# Altium schematic sheet Main.SchDoc
size A3
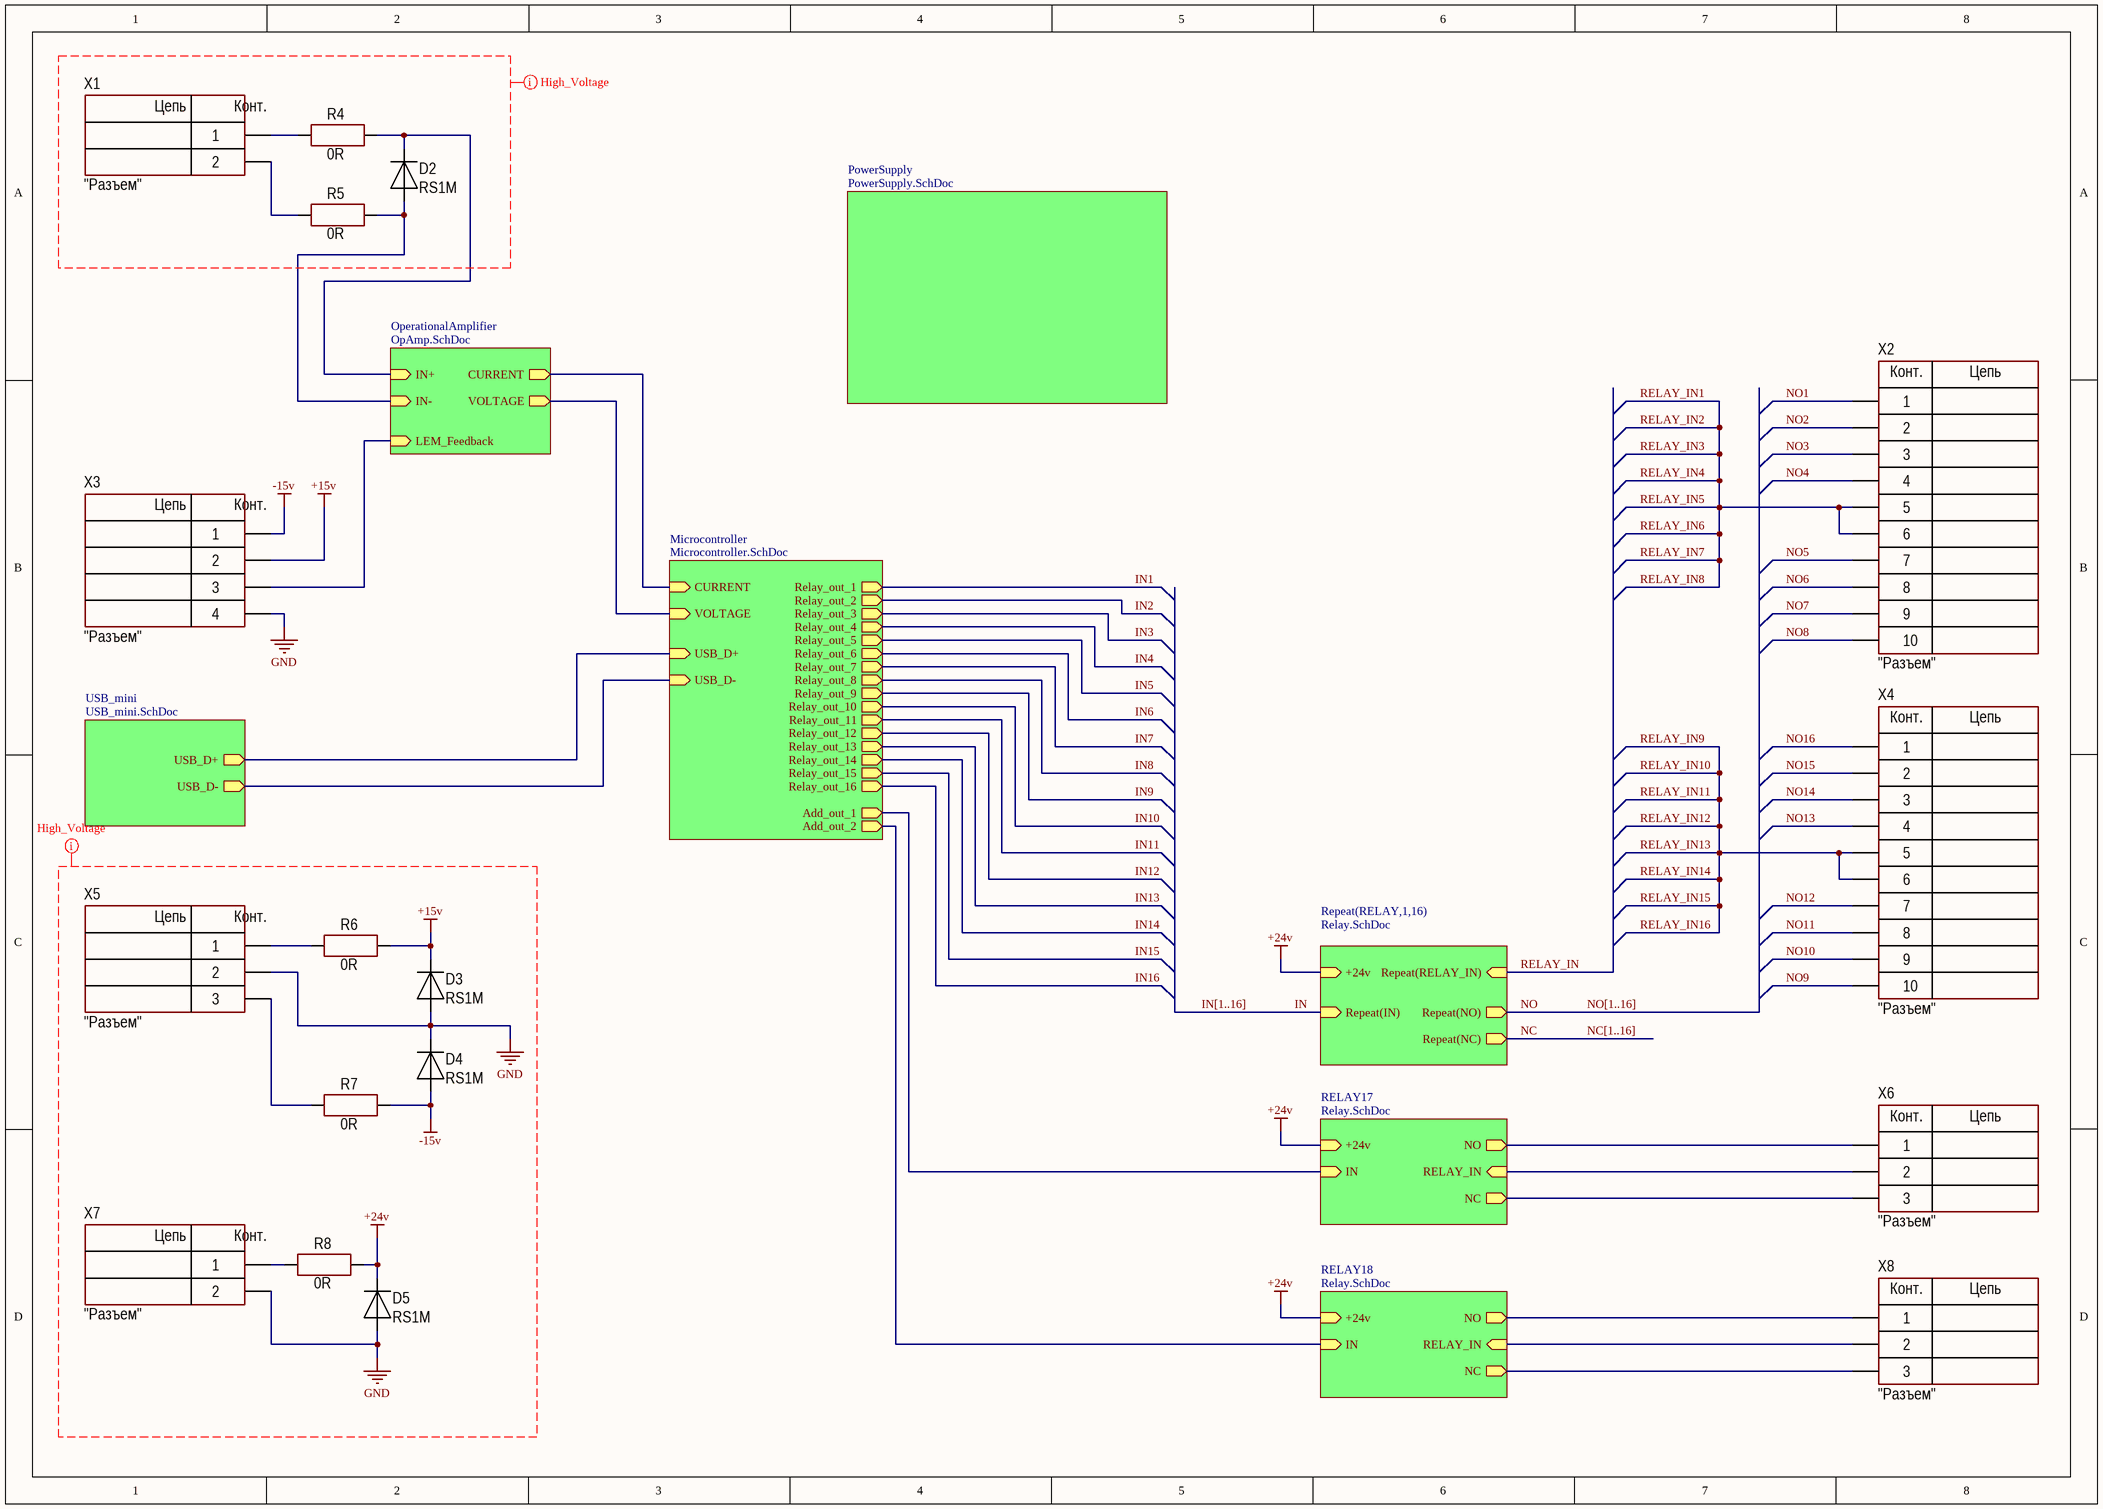
[diagram p0: Main.SchDoc]

## Parts
D2  PartNumber: RS1M  [DIODE: SMA]
D3  PartNumber: RS1M  [DIODE: SMA]
D4  PartNumber: RS1M  [DIODE: SMA]
D5  PartNumber: RS1M  [DIODE: SMA]
R4  value 0R  [RES: 1206]
R5  value 0R  [RES: 1206]
R6  value 0R  [RES: 1206]
R7  value 0R  [RES: 1206]
R8  value 0R  [RES: 1206]
X1  CommentText: "Разъем"  [300-021-12]
X2  CommentText: "Разъем"  [300-101-12]
X3  CommentText: "Разъем"  [300-041-12]
X4  CommentText: "Разъем"  [300-101-12]
X5  CommentText: "Разъем"  [300-031-12]
X6  CommentText: "Разъем"  [300-031-12]
X7  CommentText: "Разъем"  [300-021-12]
X8  CommentText: "Разъем"  [300-031-12]

## Sub-sheets
Microcontroller = Microcontroller.SchDoc: USB_D+ (in), USB_D- (in), VOLTAGE (in), CURRENT (in), Relay_out_10 (out), Relay_out_7 (out), Relay_out_14 (out), Relay_out_6 (out), Relay_out_3 (out), Relay_out_5 (out), Relay_out_11 (out), Relay_out_2 (out), Relay_out_12 (out), Relay_out_4 (out), Relay_out_1 (out), Relay_out_13 (out), Relay_out_8 (out), Relay_out_9 (out), Relay_out_16 (out), Relay_out_15 (out), Add_out_1 (out), Add_out_2 (out)
OperationalAmplifier = OpAmp.SchDoc: IN+ (in), LEM_Feedback (in), IN- (in), CURRENT (out), VOLTAGE (out)
PowerSupply = PowerSupply.SchDoc: no entries
RELAY17 = Relay.SchDoc: NC (out), IN (in), NO (out), RELAY_IN (in), +24v (in)
RELAY18 = Relay.SchDoc: +24v (in), NO (out), IN (in), RELAY_IN (in), NC (out)
Repeat(RELAY,1,16) = Relay.SchDoc: Repeat(IN) (in), +24v (in), Repeat(NO) (out), Repeat(RELAY_IN) (in), Repeat(NC) (out)
USB_mini = USB_mini.SchDoc: USB_D+ (out), USB_D- (out)

## Nets
+15v: D3.2 R6.1 X3.2
+24v: D5.2 R8.1 ; sheet Repeat(RELAY,1,16)/+24v, sheet RELAY17/+24v, sheet RELAY18/+24v
-15v: D4.1 R7.1 X3.1
GND: D3.1 D4.2 D5.1 X3.4 X5.2 X7.2
IN: sheet Repeat(RELAY,1,16)/Repeat(IN)
IN1: sheet Microcontroller/Relay_out_1
IN2: sheet Microcontroller/Relay_out_2
IN3: sheet Microcontroller/Relay_out_3
IN4: sheet Microcontroller/Relay_out_4
IN5: sheet Microcontroller/Relay_out_5
IN6: sheet Microcontroller/Relay_out_6
IN7: sheet Microcontroller/Relay_out_7
IN8: sheet Microcontroller/Relay_out_8
IN9: sheet Microcontroller/Relay_out_9
IN10: sheet Microcontroller/Relay_out_10
IN11: sheet Microcontroller/Relay_out_11
IN12: sheet Microcontroller/Relay_out_12
IN13: sheet Microcontroller/Relay_out_13
IN14: sheet Microcontroller/Relay_out_14
IN15: sheet Microcontroller/Relay_out_15
IN16: sheet Microcontroller/Relay_out_16
NC: sheet Repeat(RELAY,1,16)/Repeat(NC)
NO: sheet Repeat(RELAY,1,16)/Repeat(NO)
NO1: X2.1
NO2: X2.2
NO3: X2.3
NO4: X2.4
NO5: X2.7
NO6: X2.8
NO7: X2.9
NO8: X2.10
NO9: X4.10
NO10: X4.9
NO11: X4.8
NO12: X4.7
NO13: X4.4
NO14: X4.3
NO15: X4.2
NO16: X4.1
RELAY_IN: sheet Repeat(RELAY,1,16)/Repeat(RELAY_IN)
RELAY_IN1: X2.5 X2.6  [also labelled RELAY_IN2, RELAY_IN3, RELAY_IN4, RELAY_IN5, RELAY_IN6, RELAY_IN7, RELAY_IN8]
RELAY_IN10: X4.5 X4.6  [also labelled RELAY_IN11, RELAY_IN12, RELAY_IN13, RELAY_IN14, RELAY_IN15, RELAY_IN16, RELAY_IN9]
NetD2_1: D2.1 R5.1 ; sheet OperationalAmplifier/IN-
NetD2_2: D2.2 R4.1 ; sheet OperationalAmplifier/IN+
NetR4_2: R4.2 X1.1
NetR5_2: R5.2 X1.2
NetR6_2: R6.2 X5.1
NetR7_2: R7.2 X5.3
NetR8_2: R8.2 X7.1
NetX3_3: X3.3 ; sheet OperationalAmplifier/LEM_Feedback
NetX6_1: X6.1 ; sheet RELAY17/NO
NetX6_2: X6.2 ; sheet RELAY17/RELAY_IN
NetX6_3: X6.3 ; sheet RELAY17/NC
NetX8_1: X8.1 ; sheet RELAY18/NO
NetX8_2: X8.2 ; sheet RELAY18/RELAY_IN
NetX8_3: X8.3 ; sheet RELAY18/NC
(unnamed): sheet Microcontroller/USB_D+, sheet USB_mini/USB_D+
(unnamed): sheet Microcontroller/USB_D-, sheet USB_mini/USB_D-
(unnamed): sheet Microcontroller/VOLTAGE, sheet OperationalAmplifier/VOLTAGE
(unnamed): sheet Microcontroller/CURRENT, sheet OperationalAmplifier/CURRENT
(unnamed): sheet Microcontroller/Add_out_1, sheet RELAY17/IN
(unnamed): sheet Microcontroller/Add_out_2, sheet RELAY18/IN

## Buses and harness runs
bus IN[1..16]
bus NC[1..16]
bus NO[1..16]

## Layout directives
net class Hi_Voltage: (no net found under the mark), +15v, +24v, -15v, GND

## Notes on the sheet
- (in symbol Connector_terminal_2pin) Цепь; Конт.
- (in symbol PLS-2) Цепь; Конт.
- (in symbol PLS-3) Цепь; Конт.
- (in symbol PLS-4) Цепь; Конт.
- (in symbol PLS-10) Конт.; Цепь

## Library data of the parts
D2-D5 = Diode_single: Manufacturer: DIODES; ValueManufacturerPartNumber: RS1M, SMA; TypeDiode: Single diode; Voltage: 1000V; Current: 1A; VoltageDrop: 1V; RecoveryTime: 4ns; Package: SMA; HelpURL: https://www.digikey.com/product-detail/en/micro-commercial-co/1N4148WX-TP/1N4148WXTPMSCT-ND/717312; Temperature: -55...+150°C
R4-R8 = Resistor_1206: Manufacturer: Yageo; PartNumber: RC1206JR-07100RL; ValueManufacturerPartNumber: Resistor film, 0R, ±5%, 1206, 0.25W, -55...+125°C; TypeResistor: Resistor film; Power: 0.25W; Tolerance: ±5%; Package: 1206; HelpURL: https://www.digikey.com/product-detail/en/yageo/RC1206JR-07100RL/311-100ERCT-ND/732153; Temperature: -55...+125°C
X1 = Connector_terminal_2pin: Manufacturer: Degson; ValueManufacturerPartNumber: Terminal connector, 2pin, 3.5mm, 300VAC, 10A; PartNumber: DG350-3.5-02P-14; TypeConnector: Terminal connector; VoltageMax: 300VAC; Pitch: 3.5mm; CurrentMax: 10A; Multichannel: 2pin; HelpURL: https://www.chipdip.ru/product/dg350-3.5-02p-12
X2 X4 = PLS-10: Manufacturer: Connfly; ValueManufacturerPartNumber: Connector, 10pin, 2.54mm, 500VAC, 3A; TypeConnector: Connector; VoltageMax: 500VAC; Pitch: 2.54mm; CurrentMax: 3A; Multichannel: 10pin; HelpURL: https://www.chipdip.ru/product/pls-10; PartNumber: PLS-10
X3 = PLS-4: Manufacturer: Connfly; ValueManufacturerPartNumber: Connector, 4pin, 2.54mm, 500VAC, 3A; TypeConnector: Connector; VoltageMax: 500VAC; Pitch: 2.54mm; CurrentMax: 3A; Multichannel: 4pin; HelpURL: https://www.chipdip.ru/product/pls-4; PartNumber: PLS-4
X5 X6 X8 = PLS-3: Manufacturer: Connfly; ValueManufacturerPartNumber: Connector, 3pin, 2.54mm, 500VAC, 3A; TypeConnector: Connector; VoltageMax: 500VAC; Pitch: 2.54mm; CurrentMax: 3A; Multichannel: 3pin; HelpURL: https://www.chipdip.ru/product/pls-3; PartNumber: PLS-3
X7 = PLS-2: Manufacturer: Connfly; ValueManufacturerPartNumber: Connector, 2pin, 2.54mm, 500VAC, 3A; TypeConnector: Connector; VoltageMax: 500VAC; Pitch: 2.54mm; CurrentMax: 3A; Multichannel: 2pin; HelpURL: https://www.chipdip.ru/product/pls-2; PartNumber: PLS-2